# EAGLE schematic RotaryEncoderModule_r2_0_1 (EAGLE 9.6.2)
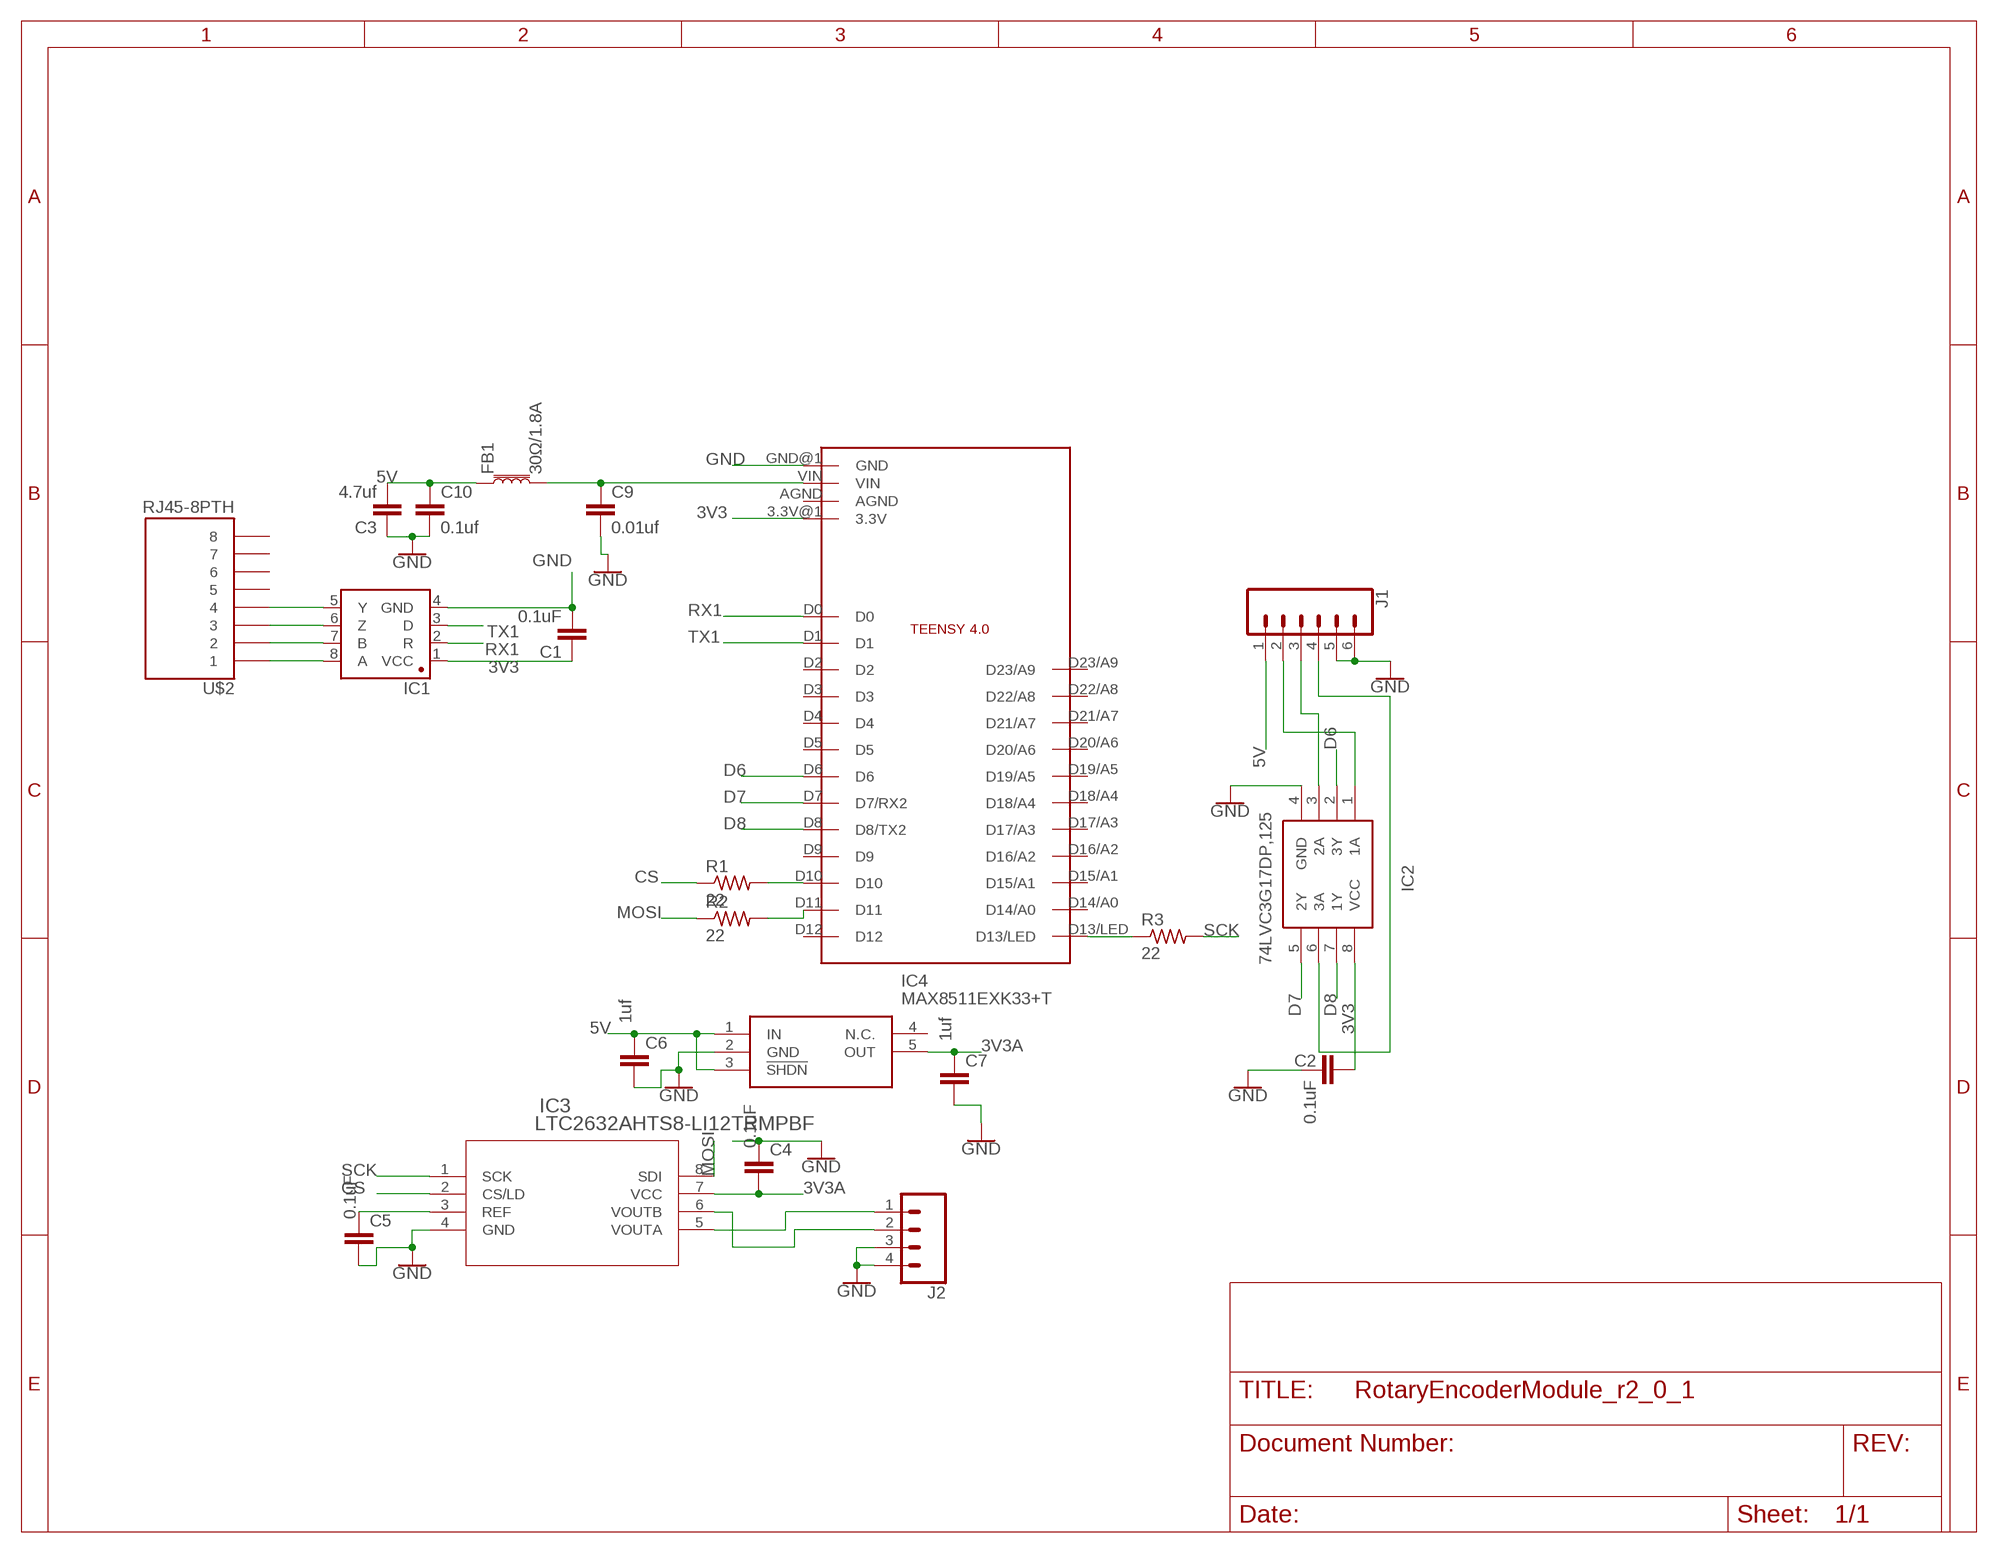
[diagram p0: schematic, sheet 1]

## Parts
C1  0.1uF  1.0UF-0805-25V-10%  [0805]
C2  0.1uF  1.0UF-0805-25V-10%  [0805]
C3  4.7uf  CAP1206  [1206@2]
C4  0.1uF  1.0UF-0805-25V-10%  [0805]
C5  0.1uF  1.0UF-0805-25V-10%  [0805]
C6  1uf  1.0UF-0805-25V-10%  [0805]
C7  1uf  1.0UF-0805-25V-10%  [0805]
C9  0.01uf  10UF-0805-10V-10%  [0805]
C10  0.1uf  10UF-0805-10V-10%  [0805]
FB1  30Ω/1.8A  FERRITE_BEAD-0603  [0603]
IC1  SN65HVD31DR  [SO08]
IC2  74LVC3G17DP,125  [SOP65P400X110-8N]
IC3  LTC2632AHTS8-LI12TRMPBF  [TSOT-23-8_1P625X2P9_ADI]
IC4  MAX8511EXK33+T  [SOT65P210X110-5N]
J1  CONN_063.5MM-6  [SCREWTERMINAL-3.5MM-6]
J2  CONN_04SCREW_LOCK  [SCREWTERMINAL-3.5MM-4_LOCK]
MC1  TEENSY4.0_SIMPLE_NO_VUSB  [TEENSY4.0_SIMPLE_NO_VUSB]
R1  22  R-US_R0805  [R0805]
R2  22  R-US_R0805  [R0805]
R3  22  R-US_R0805  [R0805]
U$2  RJ45-8PTH  [RJ45-8]

## Nets
3V3: C1.1 C2.1 IC1.1(VCC) IC2.8(VCC) MC1.3.3V@1(3.3V)
3V3A: C4.2 C7.1 IC3.7(VCC) IC4.5(OUT)
5V: C3.2 C6.1 C10.1 FB1.1 IC4.1(IN) IC4.3(!SHDN) J1.1
CS: IC3.2(CS/LD) R1.1
D6: IC2.2(3Y) MC1.D6
D7: IC2.5(2Y) MC1.D7(D7/RX2)
D8: IC2.7(1Y) MC1.D8(D8/TX2)
GND: C1.2 C2.2 C3.1 C4.1 C5.2 C6.2 C7.2 C9.2 C10.2 IC1.4(GND) IC2.4(GND) IC3.4(GND) IC4.2(GND) J1.5 J1.6 J2.3 J2.4 MC1.GND@1(GND)
MOSI: IC3.8(SDI) R2.1
N$1: IC1.6(Z) U$2.3
N$2: IC2.1(1A) J1.2
N$3: IC1.8(A) U$2.1
N$4: IC1.5(Y) U$2.4
N$5: IC1.7(B) U$2.2
N$6: IC2.3(2A) J1.3
N$7: IC2.6(3A) J1.4
N$8: IC3.5(VOUTA) J2.1
N$9: IC3.6(VOUTB) J2.2
N$10: C5.1 IC3.3(REF)
N$11: MC1.D10 R1.2
N$12: MC1.D11 R2.2
N$13: MC1.D13/LED R3.1
N$14: C9.1 FB1.2 MC1.VIN
RX1: IC1.2(R) MC1.D0
SCK: IC3.1(SCK) R3.2
TX1: IC1.3(D) MC1.D1
Unconnected: IC4.4(N.C.) MC1.AGND MC1.D2 MC1.D3 MC1.D4 MC1.D5 MC1.D9 MC1.D12 MC1.D14/A0 MC1.D15/A1 MC1.D16/A2 MC1.D17/A3 MC1.D18/A4 MC1.D19/A5 MC1.D20/A6 MC1.D21/A7 MC1.D22/A8 MC1.D23/A9 U$2.5 U$2.6 U$2.7 U$2.8

## Library data of the parts
C1 C2 C4-C7 = SparkFun-Capacitors:1.0UF: 1µF ceramic capacitors A capacitor is a passive two-terminal electrical component used to store electrical energy temporarily in an electric field.; PROD_ID: CAP-08064; VALUE: 1.0uF
C3 = SparkFun-Capacitors:CAP: Capacitor Standard 0603 ceramic capacitor, and 0.1" leaded capacitor.
C9 C10 = SparkFun-Capacitors:10UF: 10.0µF ceramic capacitors A capacitor is a passive two-terminal electrical component used to store electrical energy temporarily in an electric field.; PROD_ID: CAP-11330; VALUE: 10uF
FB1 = SparkFun-Coils:FERRITE_BEAD: Ferrite Bead (blocks, cores, rings, chokes, etc.) Inductor with layers of ferrite used to suppress high frequencies. Often used to isolate high frequency noise. SparkFun Products: IOIO-OTG - V2.2 <https://www.sparkfun.com/products/13613> SparkFun SAMD21 Mini Breakout <https://www.sparkfun.com/products/13664> SparkFun 6 Degrees of Freedom Breakout - LSM6DS3 <https://www.sparkfun.com/products/13339> SparkFun SAMD21 Dev Breakout <https://www.sparkfun.com/products/13672>; PROD_ID: NDUC-13805
IC1 = Joshparts4:SN65HVD31DR: A placeholder for generic narrow & wide SOIC8 foorptints - used on the DIP adapter board.
IC2 = SamacSys_Parts:74LVC3G17DP,125: 74LVC3G17 - Triple non-inverting Schmitt trigger with 5 V tolerant input@en-us Source: Datasheet <https://assets.nexperia.com/documents/data-sheet/74LVC3G17.pdf>; DESCRIPTION: 74LVC3G17 - Triple non-inverting Schmitt trigger with 5 V tolerant input@en-us; HEIGHT: 1.1mm; MANUFACTURER_NAME: Nexperia; MANUFACTURER_PART_NUMBER: 74LVC3G17DP,125; MOUSER_PART_NUMBER: 771-LVC3G17DP125; MOUSER_PRICE-STOCK: https://www.mouser.co.uk/ProductDetail/Nexperia/74LVC3G17DP125?qs=me8TqzrmIYUUngWcw0uHGA%3D%3D
IC3 = LTC2632:LTC2632AHTS8-LI12TRMPBF; COPYRIGHT: Copyright (C) 2022 Ultra Librarian. All rights reserved.; MANUFACTURER_PART_NUMBER: LTC2632AHTS8-LI12#TRMPBF; MFR_NAME: Analog Devices Inc
IC4 = SamacSys_Parts:MAX8511EXK33+T: LDO Voltage Regulators 120mA Linear Regulator Source: Datasheet <https://datasheets.maximintegrated.com/en/ds/MAX8510-MAX8512.pdf>; DESCRIPTION: LDO Voltage Regulators 120mA Linear Regulator; HEIGHT: 1.1mm; MANUFACTURER_NAME: Maxim Integrated; MANUFACTURER_PART_NUMBER: MAX8511EXK33+T; MOUSER_PART_NUMBER: 700-MAX8511EXK33T; MOUSER_PRICE-STOCK: https://www.mouser.co.uk/ProductDetail/Maxim-Integrated/MAX8511EXK33%2bT?qs=Jw2w9zrI6w%252Bak9NGDajN9A%3D%3D
J1 = SparkFun-Connectors:CONN_06: Multi connection point. Often used as Generic Header-pin footprint for 0.1 inch spaced/style header connections On any of the 0.1 inch spaced packages, you can populate with these: Break Away Headers - Straight <https://www.sparkfun.com/products/116> (PRT-00116) Break Away Male Headers - Right Angle <https://www.sparkfun.com/products/553> (PRT-00553) Female Headers <https://www.sparkfun.com/products/115> (PRT-00115) Break Away Headers - Machine Pin <https://www.sparkfun.com/products/117> (PRT-00117) Break Away Female Headers - Swiss Machine Pin <https://www.sparkfun.com/products/743> (PRT-00743) Arduino Stackable Header - 6 Pin <https://www.sparkfun.com/products/9280> (PRT-09280) For SCREWTERMINALS and SPRING TERMINALS visit here: Screw Terimnals on SparkFun.com <https://www.sparkfun.com/search/results?term=Screw+Terminals> (5mm/3.5mm/2.54mm spacing) This device is also useful as a general connection point to wire up your design to another part of your project. Our various solder wires solder well into these plated through hole pads. Hook-Up Wire - Assortment (Stranded, 22 AWG) <https://www.sparkfun.com/products/11375> (PRT-11375) Hook-Up Wire - Assortment (Solid Core, 22 AWG) <https://www.sparkfun.com/products/11367> (PRT-11367) View the entire wire category on our website here <https://www.sparkfun.com/categories/141>
J2 = SparkFun-Connectors:CONN_04: Multi connection point. Often used as Generic Header-pin footprint for 0.1 inch spaced/style header connections On any of the 0.1 inch spaced packages, you can populate with these: Break Away Headers - Straight <https://www.sparkfun.com/products/116> (PRT-00116) Break Away Male Headers - Right Angle <https://www.sparkfun.com/products/553> (PRT-00553) Female Headers <https://www.sparkfun.com/products/115> (PRT-00115) Break Away Headers - Machine Pin <https://www.sparkfun.com/products/117> (PRT-00117) Break Away Female Headers - Swiss Machine Pin <https://www.sparkfun.com/products/743> (PRT-00743) For SCREWTERMINALS and SPRING TERMINALS visit here: Screw Terimnals on SparkFun.com <https://www.sparkfun.com/search/results?term=Screw+Terminals> (5mm/3.5mm/2.54mm spacing) This device is also useful as a general connection point to wire up your design to another part of your project. Our various solder wires solder well into these plated through hole pads. Hook-Up Wire - Assortment (Stranded, 22 AWG) <https://www.sparkfun.com/products/11375> (PRT-11375) Hook-Up Wire - Assortment (Solid Core, 22 AWG) <https://www.sparkfun.com/products/11367> (PRT-11367) View the entire wire category on our website here <https://www.sparkfun.com/categories/141> Special notes: Molex polarized connector foot print use with SKU : PRT-08231 with associated crimp pins and housings. 1MM SMD Version SKU: PRT-10208
MC1 = Teensy4.0_SIMPLE_N_VUSB:TEENSY4.0_SIMPLE_NO_VUSB: Tennsy 4.0 simple layout (no underside pins or VUSB )
R1-R3 = adafruit:R-US_: RESISTOR, American symbol
U$2 = SparkFun:RJ45-8: RJ45 Jack Simple RJ45, 8-pin connection - connector for common Cat5, Cat5e, and Cat6 Ethernet cables. Footprint not yet proven in production. Connector sku is PRT-00643; Breakout PCB sku is BOB-00716.